# EAGLE design Lipo Booster v1 (EAGLE 6.5.0)
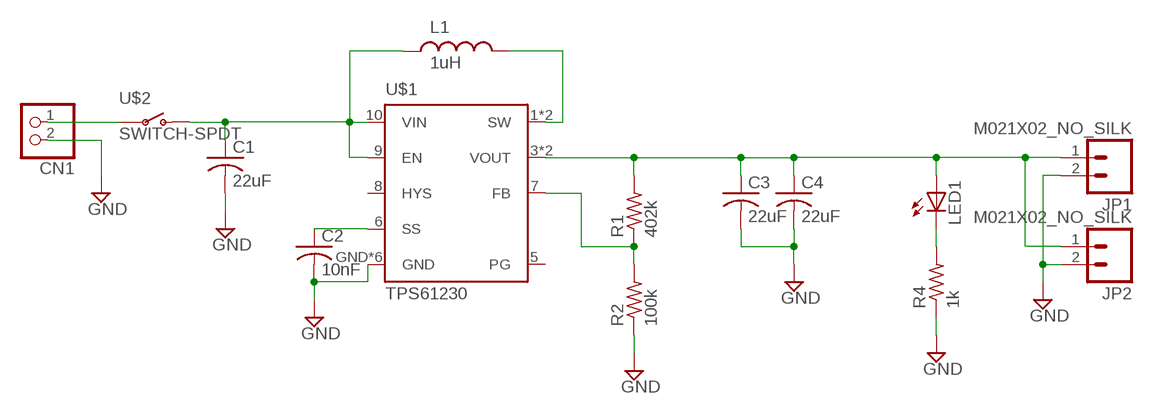
[diagram p0: schematic, sheet 1]

## Parts
C1  22uF  C-USC0603K  [C0603K]
C2  10nF  C-USC0603K  [C0603K]
C3  22uF  C-USC0603K  [C0603K]
C4  22uF  C-USC0603K  [C0603K]
CN1  JST_2PIN-SMT-RA  [JST-PH-2-SMT-RA]
JP1  M021X02_NO_SILK  [1X02_NO_SILK]
JP2  M021X02_NO_SILK  [1X02_NO_SILK]
L1  1uH  XFL4020  [XFL4020]
LED1  LEDCHIPLED_0603  [CHIPLED_0603]
R1  402k  R-US_R0603  [R0603]
R2  100k  R-US_R0603  [R0603]
R4  1k  R-US_R0603  [R0603]
U$1  TPS61230  [DRC-S-PVSON-N11]
U$2  SWITCH-SPDT  [JS102011]

## Nets
GND: C1.2 C2.2 C3.2 C4.2 CN1.2 JP1.2 JP2.2 R2.1 R4.1 U$1.GND U$1.GND@1(GND) U$1.GND@2(GND) U$1.GND@3(GND) U$1.GND@4(GND) U$1.GND@5(GND)
IND: L1.P$2 U$1.1(SW) U$1.2(SW)
N$2: LED1.C R4.2
N$3: C2.1 U$1.6(SS)
N$6: R1.1 R2.2 U$1.7(FB)
N$7: CN1.1 U$2.P$3(P)
VIN: C1.1 L1.P$1 U$1.9(EN) U$1.10(VIN) U$2.P$2(O)
VOUT: C3.1 C4.1 JP1.1 JP2.1 LED1.A R1.2 U$1.3(VOUT) U$1.4(VOUT)
Unconnected: U$1.8(HYS)

## Power pins joined to a net without a drawn wire
PG: U$1.5(PG)

## Library data of the parts
C1-C4 = adafruit:C-US: CAPACITOR, American symbol
CN1 = adafruit:JST_2PIN: JST 2-Pin Connectors of various flavors SMT-RA (S2B-PH-SM4) 4UConnector #17311 SMT (B2B-PH-SM4) THM-RA (S2B-PH) THM (B2B-PH)
JP1 JP2 = SparkFun-Connectors:M02: Standard 2-pin 0.1" header. Use with - straight break away headers ( PRT-00116) - right angle break away headers (PRT-00553) - swiss pins (PRT-00743) - machine pins (PRT-00117) - female headers (PRT-00115) Molex polarized connector foot print use with: PRT-08233 with associated crimp pins and housings. 2.54_SCREWTERM for use with PRT-10571. 3.5mm Screw Terminal footprints for PRT-08084 5mm Screw Terminal footprints for use with PRT-08433
L1 = Coilcraft:XFL4020
LED1 = adafruit:LED: LED OSRAM: - CHIPLED LG R971, LG N971, LY N971, LG Q971, LY Q971, LO R971, LY R971 LH N974, LH R974 LS Q976, LO Q976, LY Q976 LO Q996 - Hyper CHIPLED LW Q18S LB Q993, LB Q99A, LB R99A - SideLED LS A670, LO A670, LY A670, LG A670, LP A670 LB A673, LV A673, LT A673, LW A673 LH A674 LY A675 LS A676, LA A676, LO A676, LY A676, LW A676 LS A679, LY A679, LG A679 - Hyper Micro SIDELED® LS Y876, LA Y876, LO Y876, LY Y876 LT Y87S - SmartLED LW L88C, LW L88S LB L89C, LB L89S, LG L890 LS L89K, LO L89K, LY L89K LS L896, LA L896, LO L896, LY L896 - TOPLED LS T670, LO T670, LY T670, LG T670, LP T670 LSG T670, LSP T670, LSY T670, LOP T670, LYG T670 LG T671, LOG T671, LSG T671 LB T673, LV T673, LT T673, LW T673 LH T674 LS T676, LA T676, LO T676, LY T676, LB T676, LH T676, LSB T676, LW T676 LB T67C, LV T67C, LT T67C, LS T67K, LO T67K, LY T67K, LW E67C LS E67B, LA E67B, LO E67B, LY E67B, LB E67C, LV E67C, LT E67C LW T67C LS T679, LY T679, LG T679 LS T770, LO T770, LY T770, LG T770, LP T770 LB T773, LV T773, LT T773, LW T773 LH T774 LS E675, LA E675, LY E675, LS T675 LS T776, LA T776, LO T776, LY T776, LB T776 LHGB T686 LT T68C, LB T68C - Hyper Mini TOPLED® LB M676 - Mini TOPLED Santana® LG M470 LS M47K, LO M47K, LY M47K Source: http://www.osram.convergy.de/
R1 R2 R4 = adafruit:R-US_: RESISTOR, American symbol
U$1 = texas:TPS61230
U$2 = C&K Components:SWITCH-SPDT

## Board
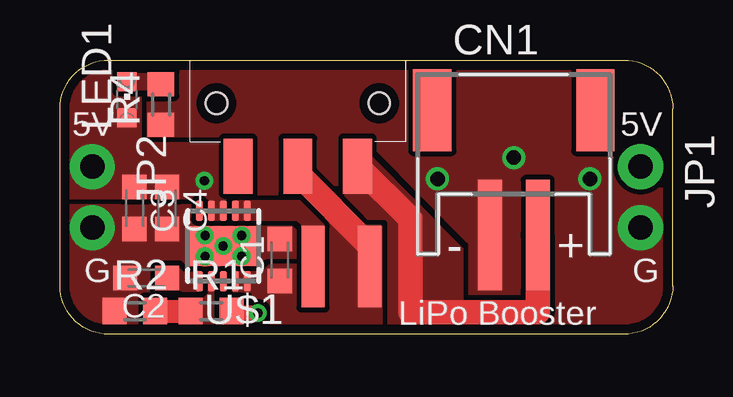
[diagram p1: board, top side]
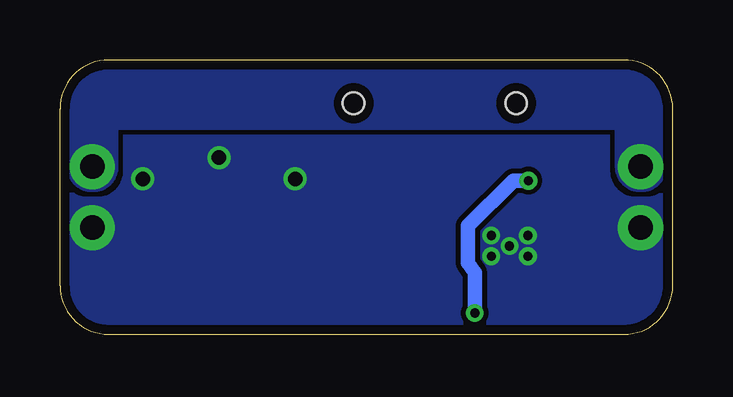
[diagram p2: board, bottom side, seen from below]

Size 25.55 x 11.43 mm. Coordinates in mm from the lower left corner, seen from the top.
Outline: 2.03,11.43 23.52,11.43 arc-90 25.55,9.4 25.55,2.03 arc-90 23.52,0 2.03,0 arc-90 0,2.03 0,9.4 arc-90 2.03,11.43
Copper layers (1*16): Top 0.0356mm / dielectric 1.5011mm / Bottom 0.0356mm
Design rules "LaenPCBOrder *": minimum track width 6mil, minimum drill 13mil, track to track 8mil, track to pad 8mil, pad to pad 8mil, via to via 8mil, smd to smd 8mil, copper to edge 15mil, drill to drill 6mil, minimum pad ring 7mil, minimum via ring 7mil, stop-mask expansion 3mil, vias tented up to drill 30mil, thermal gap 10mil

### Footprints (pad centres in the part's own frame; a part is rotated, then mirrored left to right if it is on the bottom)
C0603K = smd 1.016 x 1.016: 1 -0.875,0; 2 0.875,0
JST-PH-2-SMT-RA = smd 1 x 4.6: 1 1,-3.7; 2 -1,-3.7 | smd 1.6 x 3.4: 3 3.4,1.5; 4 -3.4,1.5
1X02_NO_SILK = drill 1.016 pad 1.88: 1 0,0; 2 2.54,0
XFL4020 = smd 0.965 x 3.404: P$1 -1.181,0; P$2 1.181,0
CHIPLED_0603 = smd 0.8 x 0.8: A 0,-0.75; C 0,0.75
R0603 = smd 1 x 1.1: 1 -0.85,0; 2 0.85,0
DRC-S-PVSON-N11 = smd 0.28 x 0.85: 1 -1,-1.475; 2 -0.5,-1.475; 3 0,-1.475; 4 0.5,-1.475; 5 1,-1.475; 6 1,1.475; 7 0.5,1.475; 8 0,1.475; 9 -0.5,1.475; 10 -1,1.475 | smd 3.099 x 1.65: GND 0,0 | drill 0.381 pad 0.559: GND@1 0,0; GND@2 -0.762,0.432; GND@3 -0.762,-0.432; GND@4 0.762,0.432; GND@5 0.762,-0.432
JS102011 = smd 1.194 x 2.286: P$1 2.489,1.143; P$2 0,1.143; P$3 -2.489,1.143 | hole 0.889: 3.391,-1.473; -3.391,-1.473

### Placement (x,y rotation side)
C1  9.17,3.1 90 top
C2  3.59,2.35 180 top
C3  3.11,5.26 270 top
C4  4.47,5.26 270 top
CN1  18.92,7.84 0 top
JP1  24.21,6.99 270 top
JP2  1.35,6.99 270 top
L1  11.73,2.82 180 top
LED1  2.79,9.77 0 top
R1  6.3,0.97 0 top
R2  3.12,0.97 0 top
R4  4.22,9.58 90 top
U$1  6.81,3.68 180 top
U$2  9.92,8.15 180 top

### Tracks (layer width: path | path; a pad name or v marks a point on that pad's centre or on a via)
GND  (via drill 0.6)
  other vias: 15.75,6.48 22.1,6.48 18.92,7.37
  pour Top (rank 6, no thermals): -2.54,13.97 27.94,13.97 27.94,-2.54 -2.54,-2.54
  pour Bottom (rank 2, no thermals): -1.27,12.7 26.67,12.7 26.67,-1.27 -1.27,-1.27
IND
  pour Top (no thermals): 7.29,5.46 7.29,4.86 9.89,4.86 10.2,4.56 10.2,4.37 10.91,4.37 10.91,4.7 10.15,5.46
N$2
  pour Top (no thermals): 2.57,10.77 4.15,10.77 4.15,10.28 2.56,10.28
N$3
  pour Top (no thermals): 5.79,2.49 5.09,2.49 4.86,2.72 4.86,2.13 5.09,1.91 5.79,1.91
N$6
  Top 0.965: R2.2 R1.1
  pour Top (no thermals): 5.4,1.35 5.96,1.35 6.3,1.68 6.3,1.84 6.31,1.84 6.31,0.51 5.11,0.51 5.08,1.24
N$7
  Top 1.016: CN1.1 19.92,0.91 14.61,0.91 14.61,4.81 U$2.P$3
  pour Top (rank 4, no thermals): 12.01,0 16.73,0 16.73,3.51 12.93,7.33 11.94,7.33
VIN
  Top 0.813: 12.88,3.72 12.88,2.86 L1.P$1
  Top 1.016: U$2.P$2 9.92,6.68 12.88,3.72
  pour Top (rank 3, no thermals): 7.29,2.5 7.29,1.85 8.12,1.85 8.12,0 13.34,0 13.34,4.45 12.19,4.45 11.81,4.83 11.26,4.84 11.26,0.8 9.98,0.79 10.01,2.81 8.79,2.81 8.48,2.5
VOUT  (via drill 0.38)
  Top 0.61: R1.2 7.22,0.89 v8.26,0.89 | 4.66,6.27 C4.1
  Bottom 0.61: v8.26,0.89 8.26,2.56 8.53,2.97 8.53,4.52 6.66,6.4 v6.02,6.4
  pour Bottom (no thermals): 2.03,11.43 arc90 0,9.4 arc-90 0.38,9.02 0.38,6.99 arc180 2.29,6.99 2.29,8.64 23.24,8.64 23.24,6.99 arc180 25.15,6.99 25.15,8.89 arc-90 25.65,9.4 arc90 23.62,11.43
  pour Top (rank 2, no thermals): 6.79,4.86 6.87,7.87 3.3,7.87 3.3,11.43 0.09,11.43 0.09,5.75 6.3,5.75 6.3,4.86

### Text on the board
tPlace: 5V | 5V | G | G | LiPo Booster